# EAGLE design contactboard (EAGLE 4.16)
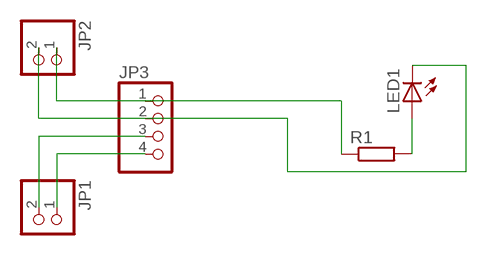
[diagram p0: schematic, sheet 1]

## Parts
JP1  PINHD-1X2  [1X02]
JP2  PINHD-1X2  [1X02]
JP3  PINHD-1X4  [1X04]
LED1  LED5MM  [LED5MM]
R1  R-EU_0207/10  [0207/10]

## Nets
N$1: JP2.1 JP3.1 R1.1
N$2: LED1.A R1.2
N$3: JP2.2 JP3.2 LED1.K(C)
N$4: JP1.2 JP3.3
N$5: JP1.1 JP3.4

## Library data of the parts
JP1 JP2 = pinhead:PINHD-1X2: PIN HEADER
JP3 = pinhead:PINHD-1X4: PIN HEADER
LED1 = led:LED: LED OSRAM: - CHIPLED LG R971, LG N971, LY N971, LG Q971, LY Q971, LO R971, LY R971 LH N974, LH R974 LS Q976, LO Q976, LY Q976 LO Q996 - Hyper CHIPLED LW Q18S LB Q993, LB Q99A, LB R99A - SideLED LS A670, LO A670, LY A670, LG A670, LP A670 LB A673, LV A673, LT A673, LW A673 LH A674 LY A675 LS A676, LA A676, LO A676, LY A676, LW A676 LS A679, LY A679, LG A679 - Hyper Micro SIDELED® LS Y876, LA Y876, LO Y876, LY Y876 LT Y87S - SmartLED LW L88C, LW L88S LB L89C, LB L89S, LG L890 LS L89K, LO L89K, LY L89K LS L896, LA L896, LO L896, LY L896 - TOPLED LS T670, LO T670, LY T670, LG T670, LP T670 LSG T670, LSP T670, LSY T670, LOP T670, LYG T670 LG T671, LOG T671, LSG T671 LB T673, LV T673, LT T673, LW T673 LH T674 LS T676, LA T676, LO T676, LY T676, LB T676, LH T676, LSB T676, LW T676 LB T67C, LV T67C, LT T67C, LS T67K, LO T67K, LY T67K, LW E67C LS E67B, LA E67B, LO E67B, LY E67B, LB E67C, LV E67C, LT E67C LW T67C LS T679, LY T679, LG T679 LS T770, LO T770, LY T770, LG T770, LP T770 LB T773, LV T773, LT T773, LW T773 LH T774 LS E675, LA E675, LY E675, LS T675 LS T776, LA T776, LO T776, LY T776, LB T776 LHGB T686 LT T68C, LB T68C - Hyper Mini TOPLED® LB M676 - Mini TOPLED Santana® LG M470 LS M47K, LO M47K, LY M47K Source: http://www.osram.convergy.de/
R1 = rcl:R-EU_: RESISTOR, European symbol

## Board
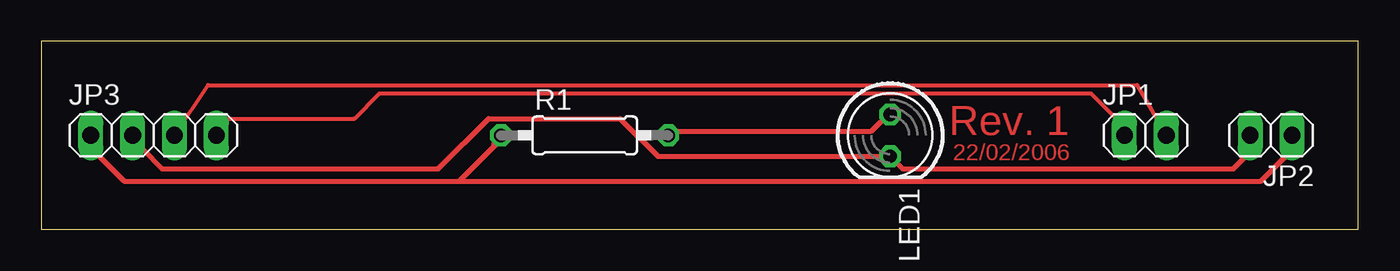
[diagram p1: board, top side]

Size 79.93 x 11.42 mm. Coordinates in mm from the lower left corner, seen from the top.
Outline: 0,0 79.93,0 79.93,11.42 0,11.42 0,0
Copper layers (1*16): Top 0.035mm / dielectric 1.5mm / Bottom 0.035mm
Design rules "default": minimum track width 10mil, minimum drill 24mil, track to track 8mil, track to pad 8mil, pad to pad 8mil, via to via 8mil, smd to smd 8mil, copper to edge 40mil, drill to drill 8mil, minimum pad ring 10mil, minimum via ring 8mil, stop-mask expansion 4mil, vias tented up to drill 0mil, thermal gap 10mil

### Footprints (pad centres in the part's own frame; a part is rotated, then mirrored left to right if it is on the bottom)
1X02 = drill 1.016 long: 1 -1.27,0; 2 1.27,0
1X04 = drill 1.016 long: 1 -3.81,0; 2 -1.27,0; 3 1.27,0; 4 3.81,0
LED5MM = drill 0.813 octagon: A -1.27,0; K 1.27,0
0207/10 = drill 0.813 octagon: 1 -5.08,0; 2 5.08,0

### Placement (x,y rotation side)
JP1  67.02,5.71 0 top
JP2  74.64,5.71 180 top
JP3  6.82,5.71 0 top
LED1  51.52,5.71 270 top
R1  32.98,5.71 0 top

### Tracks (layer width: path | path; a pad name or v marks a point on that pad's centre or on a via)
N$1
  Top 0.254: 27.52,5.2 R1.1
  Top 0.305: 25.36,2.92 27.65,5.2 | 25.36,2.92 5.04,2.92 3.52,4.44 JP3.1 | 25.36,2.92 74,2.92 75.53,4.44 JP2.1
  Top 0.406: 27.65,5.2 27.52,5.2
N$2
  Top 0.254: R1.2 38.57,5.96
  Top 0.305: 38.57,5.96 50.38,5.96 51.14,6.73 LED1.A
N$3
  Top 0.254: 73.11,4.44 72.86,4.44
  Top 0.305: JP3.2 6.18,4.82 7.33,3.68 24.09,3.68 27.14,6.73 35.14,6.73 37.43,4.44 LED1.K 52.29,3.68 72.35,3.68 73.11,4.44 | 72.86,4.44 JP2.2
N$4
  Top 0.254: JP3.3 10.12,8.76 66.51,8.76 JP1.2
N$5
  Top 0.254: JP3.4 11.14,6.73 19.01,6.73 20.54,8.25 63.72,8.25 65.24,6.73 JP1.1

### Text on the board
Top: Rev. 1 | 22/02/2006